# EasyEDA Pro project jlcProject.epro, board PCB3
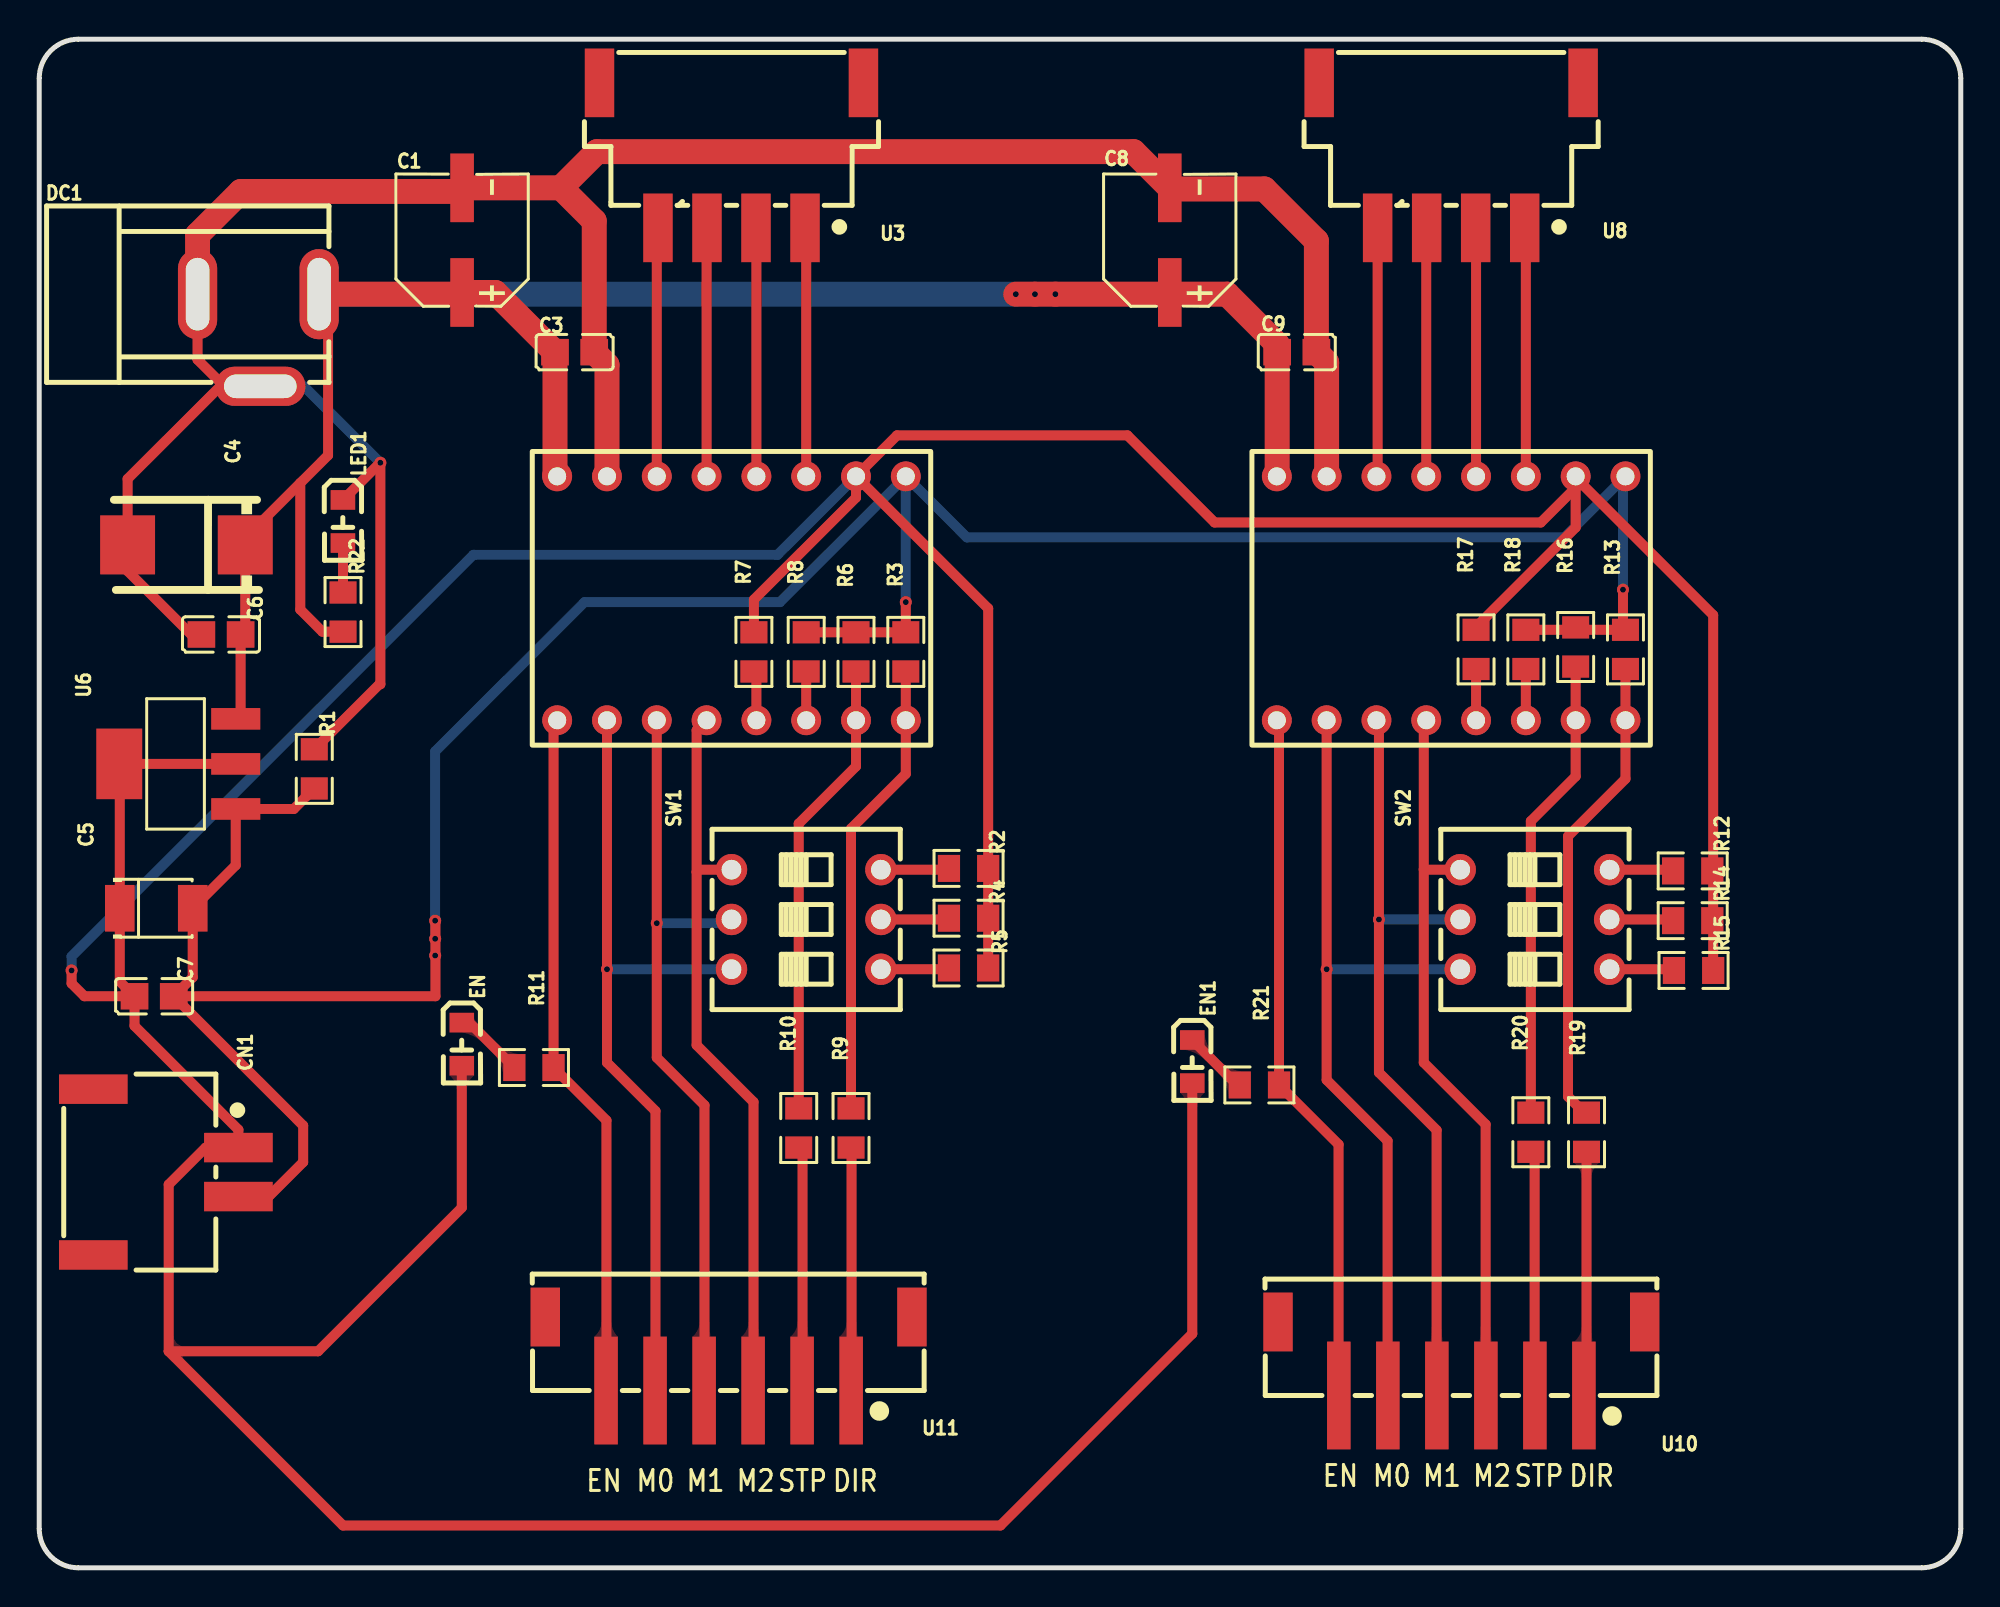
[diagram p5: board, top side]
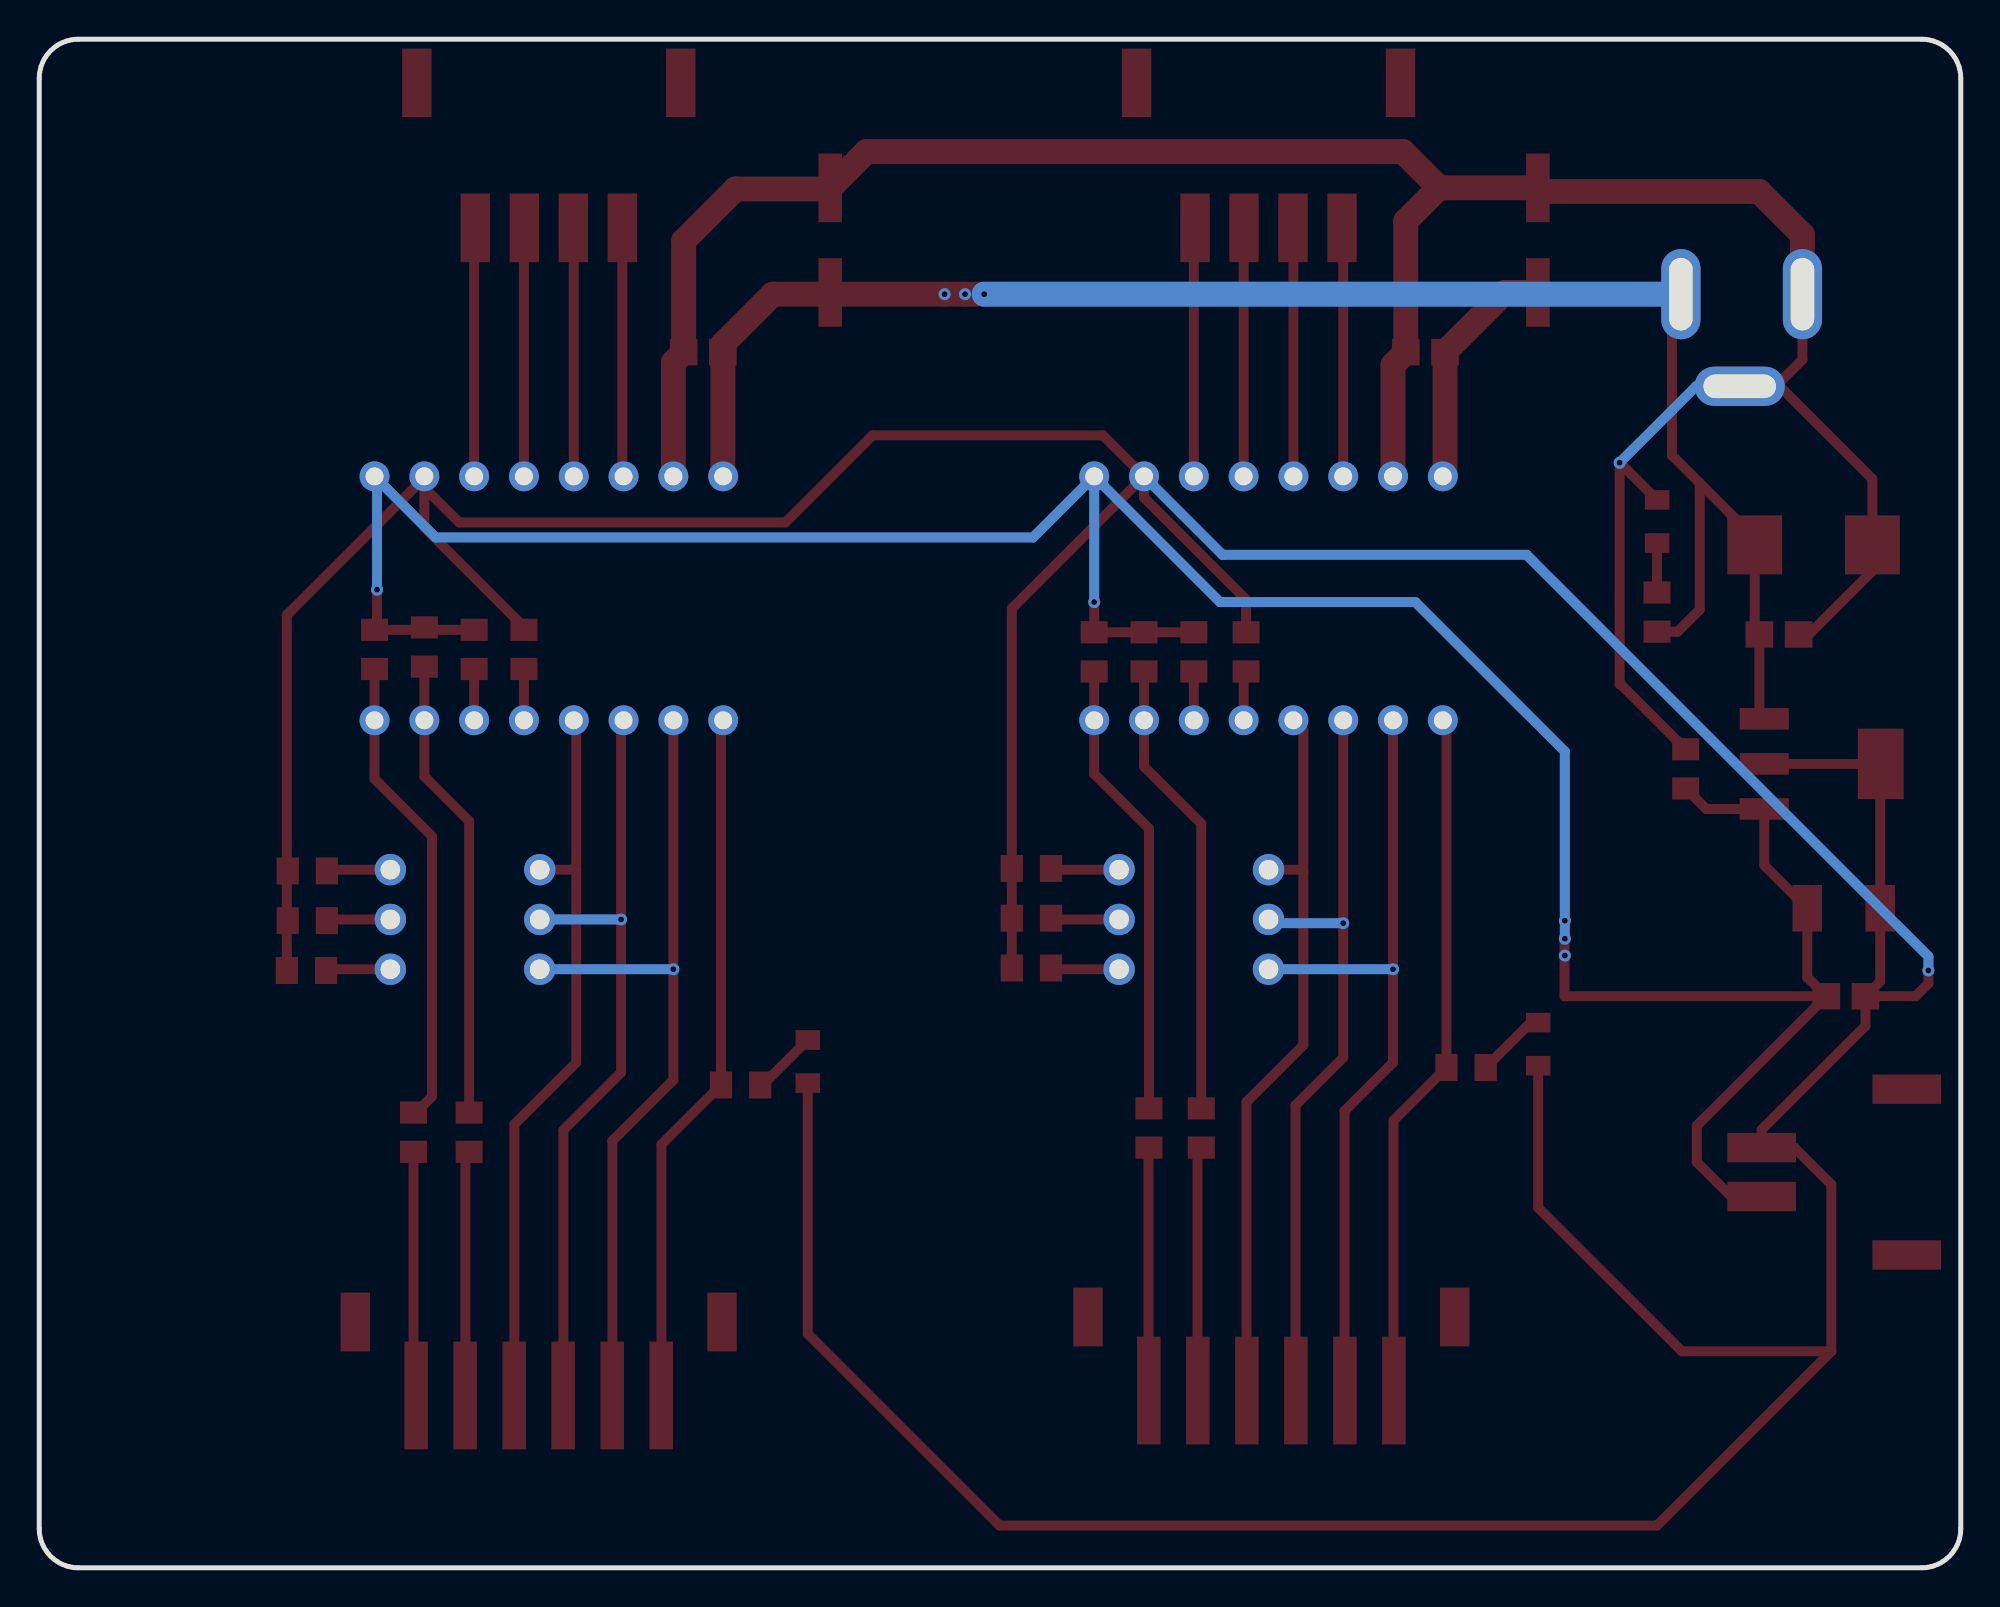
[diagram p6: board, bottom side, seen from below]

Outline 98 x 78 mm; copper layers: Top Layer, Bottom Layer. Coordinates in mm from the lower left corner of the outline.
Outline path: 0,76 0,2 arc(0.59,0.59) 2,0 96,0 arc(97.41,0.59) 98,2 98,76 arc(97.41,77.41) 96,78 2,78 arc(0.59,77.41) 0,76
Stack: Top Layer 0.035mm / Dielectric1 1.51mm FR4 er 4.5 / Bottom Layer 0.035mm

## Design rules (mm)
template: JLCPCB Capability(Two Layers Board)
spacing copperThickness1oz (default): track to track 0.102, other pairs 0.152 to 0.3
spacing copperThickness2oz: track to track 0.203, other pairs 0.152 to 0.3
track width copperThickness1oz (default): min 0.127, default 0.254, max 2.54
track width copperThickness2oz: min 0.203, default 0.254, max 2.54
differential pair differentialPair (default): width min 0.127, default 0.254, max 2.54; gap min 0.152, default 0.152
via viaSize (default): diameter min 0.5, default 0.61, max 10; hole min 0.3, default 0.305, max 6.3

## Placement (name value [footprint] x y rotation side)
C1  100uF  [CAP-SMD_BD6.3-L6.6-W6.6-LS7.6-FD]  21.57 67.75 90 top
C3  100nF  [C0805]  27.31 62.03 180 top
C4  10uF  [CASE-D_7343]  7.51 52.2 0 top
C5  10uF  [CASE-B_3528]  5.97 33.66 0 top
C6  100nF  [C0805]  9.27 47.62 0 top
C7  100nF  [C0805]  5.86 29.16 180 top
C8  100uF  [CAP-SMD_BD6.3-L6.6-W6.6-LS7.6-FD]  57.66 67.75 90 top
C9  100nF  [C0805]  64.13 62.03 180 top
CN1  ZX-XH2.54-2PWT  [CONN-SMD_2P-P2.54_MEGASTAR_ZX-XH2.54-2PWT]  6.46 20.19 270 top
DC1  DC005  [DC-IN-TH_DC005]  11.18 62.64 0 top
EN  -  [LED_0805]  21.55 26.67 270 top
EN1  -  [LED_0805]  58.8 25.78 270 top
LED1  -  [LED_0805]  15.48 53.34 270 top
R1  0  [R0805]  14.03 40.77 90 top
R2  10K  [R0805]  47.4 35.69 0 top
R3  10K  [R0805]  44.2 46.74 90 top
R4  10K  [R0805]  47.4 33.15 0 top
R5  10K  [R0805]  47.4 30.61 0 top
R6  10K  [R0805]  41.66 46.74 90 top
R7  10K  [R0805]  36.45 46.74 270 top
R8  10K  [R0805]  39.12 46.74 90 top
R9  220  [R0805]  41.4 22.44 270 top
R10  220  [R0805]  38.74 22.44 270 top
R11  470  [R0805]  25.23 25.53 180 top
R12  10K  [R0805]  84.33 35.56 0 top
R13  10K  [R0805]  80.9 46.86 90 top
R14  10K  [R0805]  84.33 33.02 0 top
R15  10K  [R0805]  84.37 30.48 0 top
R16  10K  [R0805]  78.36 46.99 90 top
R17  10K  [R0805]  73.28 46.86 270 top
R18  10K  [R0805]  75.82 46.86 90 top
R19  220  [R0805]  78.91 22.22 270 top
R20  220  [R0805]  76.07 22.22 270 top
R21  470  [R0805]  62.23 24.64 180 top
R22  2K  [R0805]  15.49 48.77 270 top
SW1  DSWB03LHGET  [SW-TH_DSWB03LHGET]  39.12 33.08 270 top
SW2  DSWB03LHGET  [SW-TH_DSWB03LHGET]  76.28 33.08 270 top
U1  -  [DRV8825驱动模块]  25.15 57.09 270 top
U3  ZX-XH2.54-4PWT  [CONN-SMD_4P-P2.50-WAFER-254W-4P]  35.31 72.07 180 top
U6  AMS1117-3.3  [SOT-223-3_L6.5-W3.4-P2.30-LS7.0-BR]  7.05 41.02 0 top
U7  -  [DRV8825驱动模块]  61.85 57.09 270 top
U8  ZX-XH2.54-4PWT  [CONN-SMD_4P-P2.50-WAFER-254W-4P]  72.01 72.07 180 top
U10  ZX-XH2.54-6PLT  [CONN-SMD_6P-P2.50_ZX-XH2.54-6PLT]  72.53 10.67 180 top
U11  ZX-XH2.54-6PLT  [CONN-SMD_6P-P2.50_ZX-XH2.54-6PLT]  35.16 10.92 180 top

## Footprints (pads in the part's own frame, mm; a bottom-side part is the same pattern mirrored in y, then rotated)
C0805
  rect 1.41x1.35 smd: 1(-1,0) 2(1,0)
CAP-SMD_BD6.3-L6.6-W6.6-LS7.6-FD
  rect 3.5x1.2 smd: 1(-2.67,0) 2(2.67,0)
CASE-B_3528
  rect 1.506x2.376 smd: 1(-1.861,0) 2(1.861,0)
CASE-D_7343
  rect 2.799x3.01 smd: 1(3,0) 2(-3,0)
CONN-SMD_2P-P2.54_MEGASTAR_ZX-XH2.54-2PWT
  rect 1.5x3.5 smd: 1(-1.25,3.7) 2(1.25,3.7) 3(-4.23,-3.7) 4(4.23,-3.7)
CONN-SMD_4P-P2.50-WAFER-254W-4P
  rect 1.5x3.5 smd: 1(-3.75,3.7) 2(-1.25,3.7) 3(1.25,3.7) 4(3.75,3.7) 5(-6.73,-3.7) 6(6.73,-3.7)
CONN-SMD_6P-P2.50_ZX-XH2.54-6PLT
  rect 1.2x5.5 smd: 1(-6.25,1.875) 2(-3.75,1.875) 3(-1.25,1.875) 4(1.25,1.875) 5(3.75,1.875) 6(6.25,1.875)
  rect 1.5x3 smd: 7(9.35,-1.875) 8(-9.35,-1.875)
DC-IN-TH_DC005
  oval 2x4.6 hole 1.2x3.7: 1(3.1,2.35) 2(-3.1,2.35)
  oval 4.6x2 hole 3.7x1.2: 3(0.1,-2.35)
DRV8825驱动模块
  round 1.524 hole 0.914: 1(1.397,19.05) 2(1.397,16.51) 3(1.397,13.97) 4(1.397,11.43) 5(1.397,8.89) 6(1.397,6.35) 7(1.397,3.81) 8(1.397,1.27) 9(13.843,1.27) 10(13.843,3.81) 11(13.843,6.35) 12(13.843,8.89) 13(13.843,11.43) 14(13.843,13.97) 15(13.843,16.51) 16(13.843,19.05)
LED_0805
  rect 1x1.25 smd: 1(-1.15,0.005) 2(1.05,0.005)
R0805
  rect 1.133x1.377 smd: 1(-1,0) 2(1,0)
SOT-223-3_L6.5-W3.4-P2.30-LS7.0-BR
  rect 2.5x1.1 smd: 1(2.97,-2.3) 2(2.97,0) 3(2.97,2.3)
  rect 2.34x3.6 smd: 4(-2.97,0)
SW-TH_DSWB03LHGET
  round 1.6 hole 1: 1(-2.54,3.81) 2(0,3.81) 3(2.54,3.81) 4(-2.54,-3.81) 5(0,-3.81) 6(2.54,-3.81)

## Nets
As in the schematic.

Pads without a net: CN1 3 4; U3 5 6; U8 5 6; U10 7 8; U11 7 8

## Via types
v1: diameter 0.61, hole 0.305, Top Layer to Bottom Layer, 14 vias

## Routing (per net, layer and track width the routed paths; a pad name or vN(x,y) marks a point on that pad's centre or on a via; arc(x,y) is an arc through that point)
3.3V: length 310
  Top Layer w0.508: R15.2 85.37,35.52 ; 85.37,35.52 R12.2 ; 85.37,35.52 85.37,48.61 78.36,55.63 ; 78.36,55.12 78.36,55.63 ; 78.36,55.12 76.58,53.34 59.94,53.34 55.5,57.78 43.75,57.78 U1.2 ; 78.36,55.12 78.36,53.09 73.28,48.01 R17.1 ; 78.36,55.63 78.36,55.69 ; C7.2 2.31,29.16 1.65,29.82 v1(1.65,30.48) ; C7.2 4.11,29.92 C5.1 4.11,41 U6.4 U6.2 ; C7.2 4.86,27.65 10.16,22.35 CN1.1 8.49,21.44 6.6,19.56 6.6,11.05 ; R7.1 36.45,49.4 41.66,54.61 U1.2 ; EN1.2 58.81,11.94 49.02,2.16 15.49,2.16 6.6,11.05 ; U1.2 48.4,48.95 R2.2 R4.2 R5.2 ; EN.2 21.55,18.38 14.22,11.05 6.6,11.05
  Bottom Layer w0.508: v1(1.65,30.48) 1.65,31.2 22.14,51.69 37.65,51.69 U1.2
12V: length 109.4
  Top Layer w0.508: DC1.1 14.73,64.53 14.73,56.77 13.31,55.35 ; 13.31,55.35 13.31,48.89 14.44,47.77 R22.2 ; 13.31,55.35 10.51,52.55 C4.1 10.51,47.86 C6.2 10.27,43.57 U6.3
  Top Layer w1.27: v1(49.81,64.99) v1(50.78,64.99) v1(51.82,64.99) 57.57,64.99 C8.1 57.75,64.99 60.59,64.99 63.13,62.44 C9.2 63.13,55.71 U7.8 ; U1.8 26.31,55.8 C3.2 23.26,65.08 C1.1 21.48,64.99 DC1.1
  Bottom Layer w1.27: DC1.1 v1(49.81,64.99)
AGND: length 141.9
  Top Layer w0.508: LED1.1 17.39,56.39 v1(17.4,56.39) 17.4,45.08 17.35,45.08 R1.2 ; 9.43,60.29 8.08,61.65 DC1.2 ; 9.43,60.29 9.23,60.29 4.51,55.56 C4.2 4.51,50.86 7.75,47.62 C6.1 ; 9.43,60.29 DC1.3
  Top Layer w1.27: U7.7 65.66,61.51 C9.1 65.13,67.71 62.48,70.36 57.72,70.36 C8.2 55.81,72.26 28.45,72.26 26.61,70.42 ; 26.61,70.42 26.47,70.42 C1.2 21.38,70.23 10.29,70.23 8.08,68.02 DC1.2 ; 26.61,70.42 28.31,68.72 C3.1 28.96,61.38 U1.7
  Bottom Layer w0.508: DC1.3 13.5,60.29 v1(17.4,56.39)
GND: length 152.1
  Top Layer w0.508: R1.1 12.98,38.72 U6.1 10.02,35.85 C5.2 7.83,30.13 C7.1 ; C7.1 13.46,22.56 13.46,20.7 11.7,18.94 CN1.2 ; C7.1 20.21,29.16 20.21,33 v1(20.19,33.02) ; R8.2 R6.2 R3.2 v1(44.2,49.28) ; R18.2 80.77,47.86 v1(80.77,49.91)
  Bottom Layer w0.508: U1.1 47.31,52.58 77.78,52.58 80.77,55.57 ; U1.1 v1(44.2,49.28) ; U1.1 37.78,49.28 27.81,49.28 20.19,41.66 v1(20.19,33.02) v1(20.19,32.1) ; 80.77,55.57 U7.1 ; 80.77,55.57 v1(80.77,49.91)
  vias: v1(20.19,31.24)
$1N1102: length 12.7
  Top Layer w0.508: U1.3 39.12,68.31 U3.1
$1N1109: length 12.7
  Top Layer w0.508: U1.4 36.58,68.35 U3.2
$1N1116: length 12.7
  Top Layer w0.508: U3.3 34.04,68.35 U1.5
$1N1123: length 12.7
  Top Layer w0.508: U1.6 31.5,68.31 U3.4
$1N1274: length 34.6
  Top Layer w0.508: 28.93,9.8 28.93,22.83 R11.1 26.23,43.06 U1.9
$1N1506: length 36.7
  Top Layer w0.508: U1.12 33.53,42.74 33.53,35.5 ; 36.43,9.8 36.43,23.77 33.53,26.67 33.53,35.5 ; 33.53,35.5 33.65,35.62 SW1.4
$1N1515: length 38.3
  Top Layer w0.508: 33.93,9.8 33.93,23.6 31.5,26.03 v1(31.5,32.89) U1.11
  Bottom Layer w0.508: v1(31.5,32.89) 35.12,32.89 SW1.5
$1N1524: length 40.8
  Top Layer w0.508: U1.10 v1(28.96,30.54) ; v1(28.96,30.54) 28.96,30.53 ; v1(28.96,30.54) 28.96,25.78 31.43,23.31 31.43,9.8
  Bottom Layer w0.508: 35.31,30.54 v1(28.96,30.54)
$1N1862: length 3.5
  Top Layer w0.508: R4.1 46.33,33.08 SW1.2
$1N1866: length 3.5
  Top Layer w0.508: 42.93,30.54 46.33,30.54 R5.1
$1N1873: length 3.5
  Top Layer w0.508: R2.1 46.33,35.62 SW1.1
$1N1945: length 2.5
  Top Layer w0.508: U1.13 36.58,45.61 R7.2
$1N1999: length 2.5
  Top Layer w0.508: R8.1 U1.14
$1N2088: length 11.7
  Top Layer w0.508: 38.93,9.8 38.93,21.25 R10.2
$1N2106: length 23.5
  Top Layer w0.508: R3.1 U1.16 44.2,40.51 41.4,37.72 R9.1
$1N2111: length 23.5
  Top Layer w0.508: R6.1 U1.15 41.66,40.89 38.74,37.97 R10.1
$1N2116: length 11.7
  Top Layer w0.508: 41.43,9.8 41.43,21.42 R9.2
$1N2168: length 3.6
  Top Layer w0.508: R11.2 21.94,27.82 EN.1
$1N4183: length 12.7
  Top Layer w0.508: U8.1 75.82,68.31 U7.3
$1N4184: length 12.7
  Top Layer w0.508: U8.2 73.28,68.35 U7.4
$1N4185: length 12.7
  Top Layer w0.508: 70.74,55.69 70.74,68.35 U8.3
$1N4186: length 12.7
  Top Layer w0.508: 68.2,55.69 68.26,55.75 U8.4
$1N4187: length 35.8
  Top Layer w0.508: U10.6 66.27,8.81 66.27,21.6 R21.1 63.23,43.14 U7.9
$1N4188: length 37.7
  Top Layer w0.508: SW2.4 70.63,35.62 70.61,35.64 ; 70.74,43.25 70.61,43.12 70.61,35.64 ; 70.61,35.64 70.61,25.78 73.77,22.63 73.77,8.81 U10.3
$1N4189: length 39.9
  Top Layer w0.508: U10.4 71.27,8.81 71.27,22.33 68.33,25.27 v1(68.33,33.08) 68.33,43.12 68.2,43.25
  Bottom Layer w0.508: SW2.5 v1(68.33,33.08)
$1N4190: length 42.6
  Top Layer w0.508: U10.5 68.77,8.81 68.77,21.78 65.66,24.89 v1(65.66,30.54) U7.10
  Bottom Layer w0.508: 72.47,30.54 v1(65.66,30.54)
$1N4193: length 3.3
  Top Layer w0.508: SW2.2 83.27,33.08 R14.1
$1N4194: length 3.3
  Top Layer w0.508: R15.1 83.31,30.54 80.09,30.54
$1N4195: length 3.3
  Top Layer w0.508: R12.1 83.26,35.62 SW2.1
$1N4196: length 2.7
  Top Layer w0.508: U7.13 73.28,45.74 73.15,45.86
$1N4197: length 2.6
  Top Layer w0.508: R18.1 U7.14
$1N4198: length 12.5
  Top Layer w0.508: R20.2 76.27,21.03 76.27,8.81 U10.2
$1N4199: length 24.3
  Top Layer w0.508: R19.1 78.79,23.22 77.97,24.05 77.97,37.33 80.9,40.26 U7.16 R13.1
$1N4200: length 23.7
  Top Layer w0.508: R20.1 76.07,38.1 78.36,40.39 R16.1
$1N4201: length 11.6
  Top Layer w0.508: 78.77,9.8 78.91,9.8 R19.2
$1N4202: length 3.4
  Top Layer w0.508: EN1.1 61.1,24.64 R21.2
$1N4282: length 2.5
  Top Layer w0.508: R22.1 15.49,52.28 LED1.2

Small or netless copper shapes (teardrops, artwork), in the pictures only: 16 on Top Layer

## Text on the board
Top Silkscreen Layer: EN | M0 | M1 | M2 | STP | DIR
